# Altium project Powerboard_SAUVC26.PrjPcb
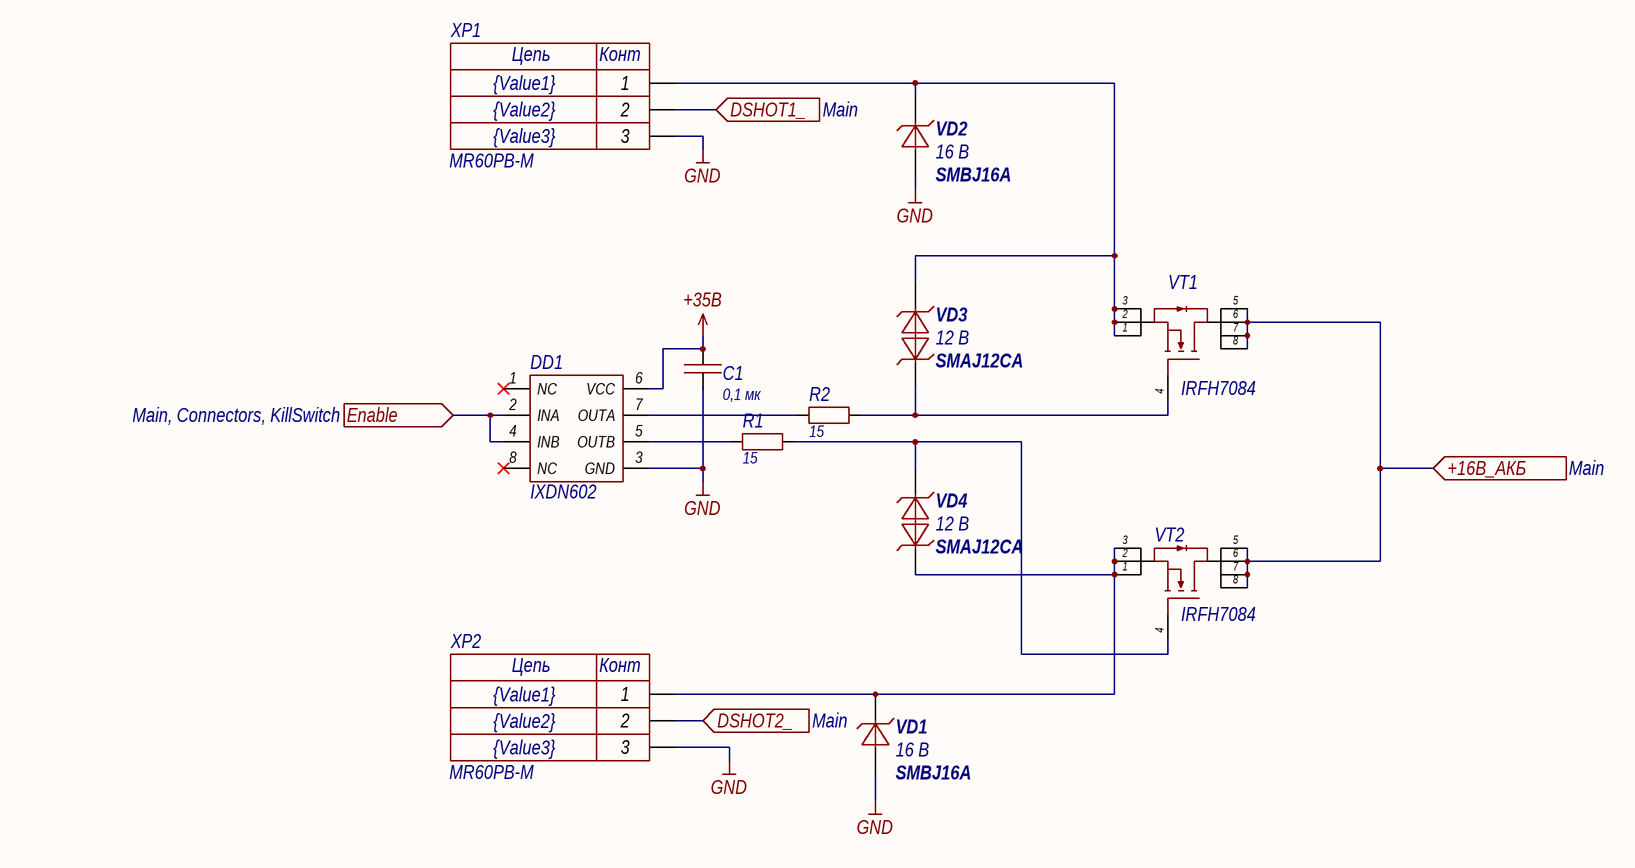
[diagram p0: Transistors.SchDoc]
CheckedBy: Карманов С.; Decimal_Number_PCB: ГИДР.123456.015; Decimal_Number_Shematic: ГИДР.123456.015; DrawnBy: Михайловский Г.; Release_Date: 14.09.25; Title: Плата силовая; Version: 01
2 sheets, 21 parts. Net scope: flat (ports and power ports of the same name join across sheets).
Board file: Powerboard_SAUVC26.PcbDoc
Sheets:
  Transistors.SchDoc
  KillSwitch.SchDoc

## Sheet Transistors.SchDoc: Плата силовая
size 420 x 297 mm; SheetNumber: 3; SheetTotal: 4

### Parts
C1  value 0,1 мк  [0603C]  (hidden comment: Capacitor)
DD1  IXDN602  [SOIC-8]
R1  value 15  [0603R]  (hidden comment: Resistor)
R2  value 15  [0603R]  (hidden comment: Resistor)
VD1  SMBJ16A  value 16 В  [SMB]
VD2  SMBJ16A  value 16 В  [SMB]
VD3  SMAJ12CA  value 12 В  [SMA]
VD4  SMAJ12CA  value 12 В  [SMA]
VT1  IRFH7084  [PQFN_5x6]
VT2  IRFH7084  [PQFN_5x6]
XP1  MR60PB-M  Value3: {Value3}  Value2: {Value2}  Value1: {Value1}  [MR60PB-M]
XP2  MR60PB-M  Value3: {Value3}  Value2: {Value2}  Value1: {Value1}  [MR60PB-M]

### Ports
+16В_АКБ (in, see Main), DSHOT1_ (in, see Main), DSHOT2_ (in, see Main), Enable (in, see Main, Connectors, KillSwitch)

### Nets
+35В: C1.2 DD1.6(VCC)
GND: C1.1 DD1.3(GND) VD1.1 VD2.1 XP1.3 XP2.3
Enable: DD1.2(INA) DD1.4(INB) ; port Enable
NetDD1_5: DD1.5(OUTB) R1.1
NetDD1_7: DD1.7(OUTA) R2.1
NetR1_2: R1.2 VD4.2 VT2.4
NetR2_2: R2.2 VD3.1 VT1.4
NetVD1_2: VD1.2 VD4.1 VT2.1 VT2.2 VT2.3 XP2.1
NetVD2_2: VD2.2 VD3.2 VT1.1 VT1.2 VT1.3 XP1.1
NetVT1_5: VT1.5 VT1.6 VT1.7 VT1.8 VT2.5 VT2.6 VT2.7 VT2.8 ; port +16В_АКБ
NetXP1_2: XP1.2 ; port DSHOT1_
NetXP2_2: XP2.2 ; port DSHOT2_

Not connected (* = marked no-connect by the designer): DD1 1(NC)* 8(NC)*

### Notes on the sheet
- Перв. примен.
- Справ. №
- Подп. и дата
- Инв. № дубл.
- Взам. инв. №
- Инв. № подл.
- Изм.
- Лист
- № докум.
- Подп.
- Дата
- Копировал
- Формат А3
- (in symbol MR60PB-M) Цепь; Конт

### Library data of the parts
C1 = Capacitor_0,1u_10_50V_X7R_0603C: Конденсатор; Library Path2: Schematic\Capacitor.SchLib; Tolerance: 0,1; Voltage (V): 50; Dielectric: X7R; Capacity (nF): 100; Part Number: Capacitor_0,1u_10_50V_X7R_0603C
DD1 = IXDN602: Двухканальный драйвер затвора для mosfet и igbt транзисторов; Part Number: IXDN602
R1 R2 = Resistor_15_1_0603: Резистор номиналом 15 Ом 1%; Power: *; Part Number: Resistor_15_1_0603; Tolerance: 1%
VD1 VD2 = SMBJ16A: Защитный диод на 16 В, рассеиваемая мощность 600 Вт; Voltage nominal (V): 16; Power (W): 600; Part Number: SMBJ16A
VD3 VD4 = SMAJ12CA: Защитный диод на 12 В, рассеиваемая мощность 400 Вт; Voltage nominal (V): 12; Power (W): 400; Part Number: SMAJ12CA
VT1 VT2 = IRFH7084: N-канальный MOSFET; Voltage (V): 40 В; Current (A): 100 А; Part Number: IRFH7084
XP1 XP2 = MR60PB-M: 60 А (40 продолжительно), 3 контакта, прямой отец; System: Connector; Part Number: MR60PB-M

## Sheet KillSwitch.SchDoc: Плата силовая
size 420 x 297 mm; SheetNumber: 4; SheetTotal: 4
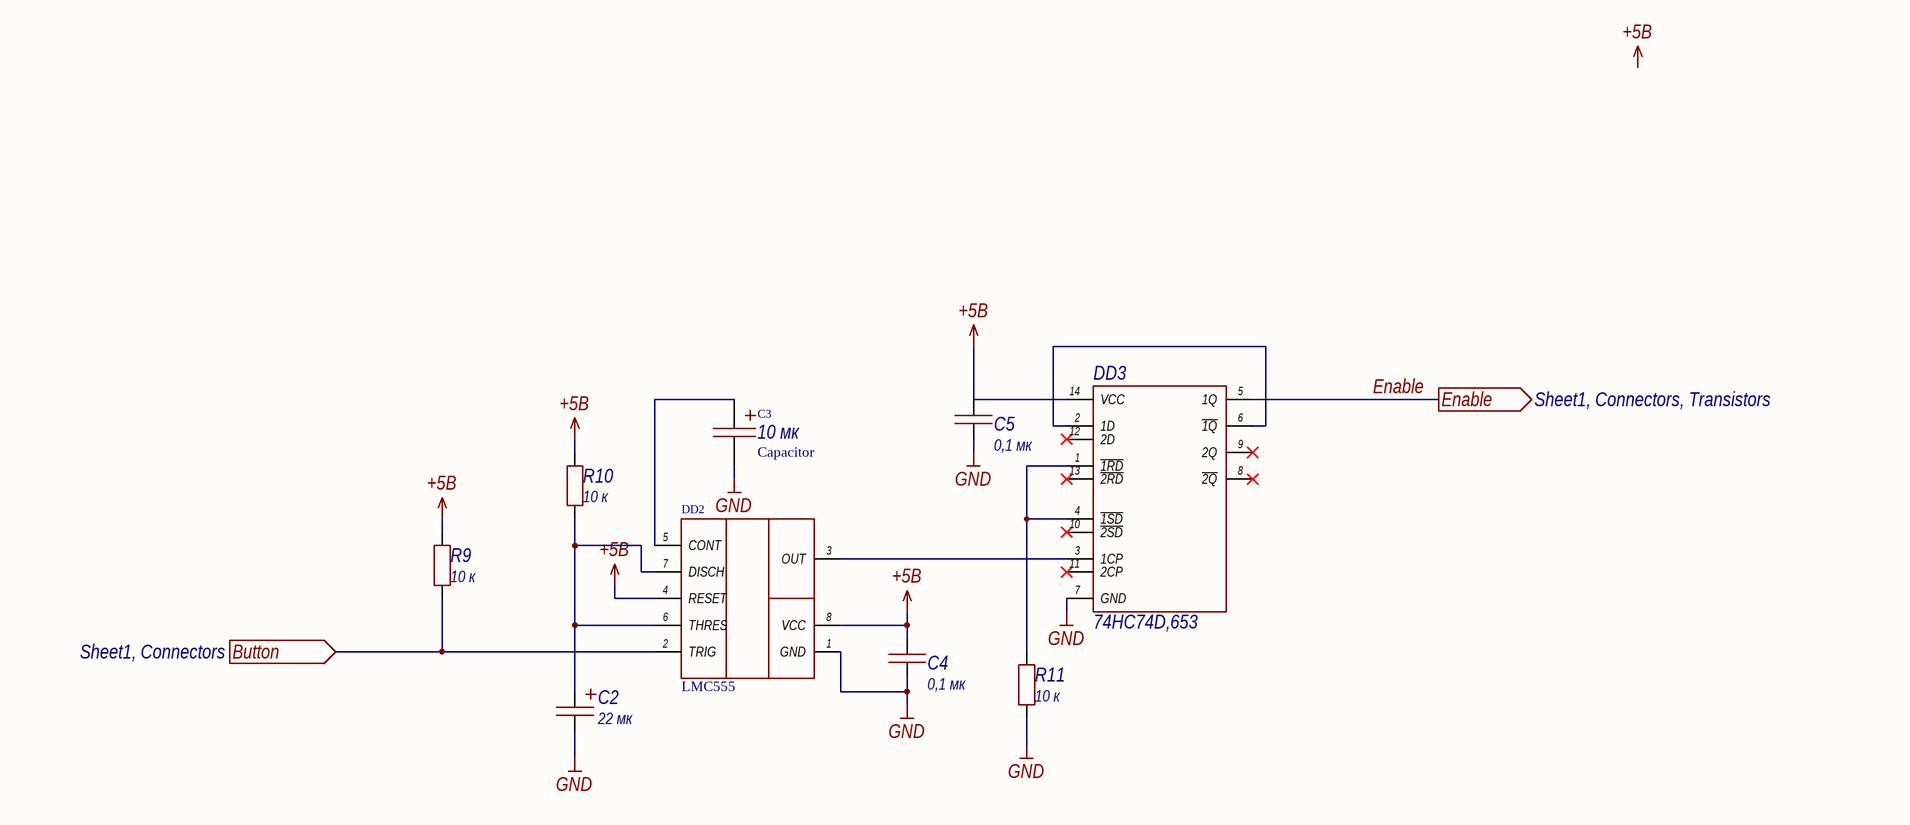
[diagram p1: KillSwitch.SchDoc]

### Parts
C2  value 22 мк  [TC_A]  (hidden comment: Capacitor)
C3  Capacitor  value 10 мк  [TC_A]
C4  value 0,1 мк  [0603C]  (hidden comment: Capacitor)
C5  value 0,1 мк  [0603C]  (hidden comment: Capacitor)
DD2  LMC555  [SOIC-8]
DD3  74HC74D,653  [SOIC-14]
R9  value 10 к  [0603R]  (hidden comment: Resistor)
R10  value 10 к  [0603R]  (hidden comment: Resistor)
R11  value 10 к  [0603R]  (hidden comment: Resistor)

### Ports
Button (in, see Sheet1, Connectors), Enable (out, see Sheet1, Connectors, Transistors)

### Nets
+5В: C4.2 C5.1 DD2.4(RESET) DD2.8(VCC) DD3.14(VCC) R9.2 R10.2
GND: C2.2 C3.2 C4.1 C5.2 DD2.1(GND) DD3.7(GND) R11.1
Enable: DD3.5(1Q) ; port Enable
NetC2_1: C2.1 DD2.6(THRES) DD2.7(DISCH) R10.1
NetC3_1: C3.1 DD2.5(CONT)
NetDD2_2: DD2.2(TRIG) R9.1 ; port Button
NetDD2_3: DD2.3(OUT) DD3.3(1CP)
NetDD3_1: DD3.1(~{1RD}) DD3.4(~{1SD}) R11.2
NetDD3_2: DD3.2(1D) DD3.6(~{1Q})

Not connected (* = marked no-connect by the designer): DD3 8(~{2Q})* 9(2Q)* 10(~{2SD})* 11(2CP)* 12(2D)* 13(~{2RD})*

### Notes on the sheet
- Labels drawn without touching a wire or pin: +5В
- Перв. примен.
- Справ. №
- Подп. и дата
- Инв. № дубл.
- Взам. инв. №
- Инв. № подл.
- Изм.
- Лист
- № докум.
- Подп.
- Дата
- Копировал
- Формат А3

### Library data of the parts
C2 = Capacitor_22u_10_50V_TC_A: Танталовый конденсатор; Tolerance: 0,1; Voltage (V): 50; Type: Tantalum; Capacity (uF): 22; Part Number: Capacitor_22u_10_50V_TC_A
C3 = Capacitor_10u_10_50V_TC_A: Танталовый конденсатор; Tolerance: 0,1; Voltage (V): 50; Type: Tantalum; Capacity (uF): 10; Part Number: Capacitor_10u_10_50V_TC_A
C4 C5 = Capacitor_0,1u_10_50V_X7R_0603C: as C1 on sheet Transistors; Part Number: Capacitor_0,1u_10_50V_X7R_0603C
DD2 = LMC555: Таймер интегральный прецизионный КМОП; Part Number: LMC555
DD3 = 74HC74D,653: Два триггера D-типа; MF: Nexperia USA; SnapEDA_Link: https://www.snapeda.com/parts/74HC74D,653/Nexperia/view-part/?ref=snap; Package: SO14-14 Nexperia USA Inc.; Value: *; MP: 74HC74D,653; Check_prices: https://www.snapeda.com/parts/74HC74D,653/Nexperia/view-part/?ref=eda; Part Number: 74HC74D,653
R9-R11 = Resistor_10k_1_0603: Резистор номиналом 10 кОм и точностью 1%; Power: *; Part Number: Resistor_10k_1_0603; Tolerance: 1%

## Nets that join several sheets
GND: Transistors (6 pins), KillSwitch (7 pins)
Enable: Transistors (DD1.2 DD1.4), KillSwitch (DD3.5)

## Assembly variants
01: all parts fitted